# Altium schematic sheet SH08-PWR1.SchDoc
size A4
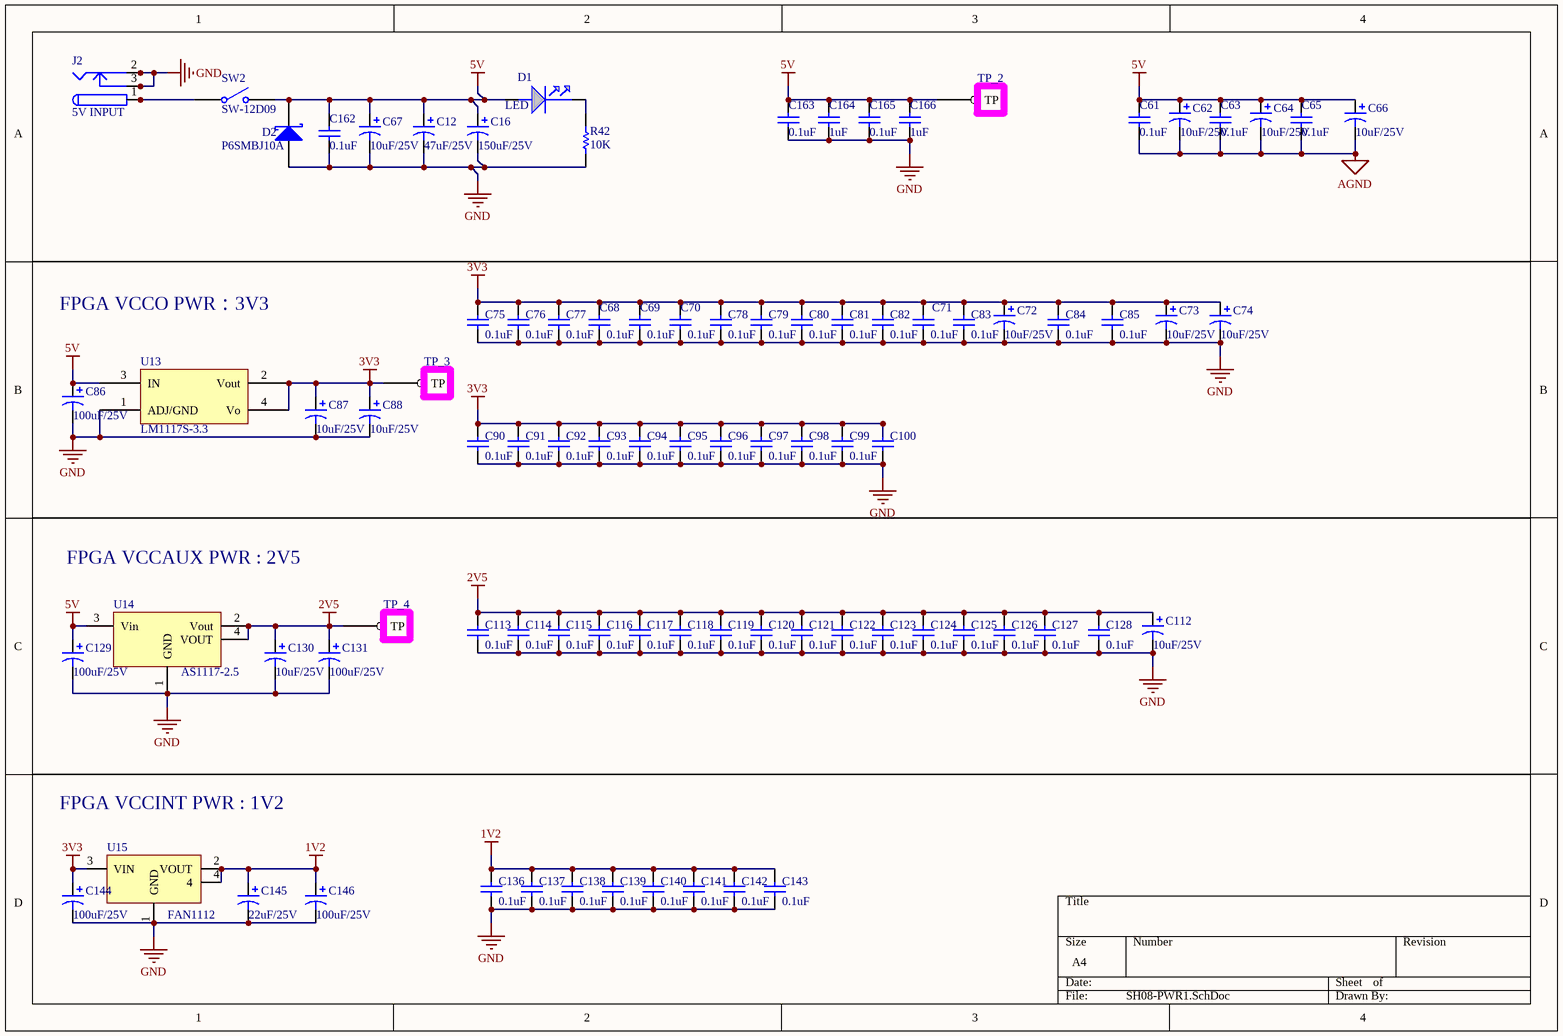
[diagram p0: SH08-PWR1.SchDoc]

## Parts
C12  value 47uF/25V  [1210[3528]]  (hidden comment: Cap Pol,47uF/25V,1210)
C16  value 150uF/25V  [7343]  (hidden comment: Cap Pol,150uF/25V,7343)
C61  value 0.1uF  [1608[0603]]  (hidden comment: Cap,0.1uF/0603)
C62  value 10uF/25V  [1206[3216]]  (hidden comment: Cap Pol,10uF/25V,1206)
C63  value 0.1uF  [1608[0603]]  (hidden comment: Cap,0.1uF/0603)
C64  value 10uF/25V  [1206[3216]]  (hidden comment: Cap Pol,10uF/25V,1206)
C65  value 0.1uF  [1608[0603]]  (hidden comment: Cap,0.1uF/0603)
C66  value 10uF/25V  [1206[3216]]  (hidden comment: Cap Pol,10uF/25V,1206)
C67  value 10uF/25V  [1206[3216]]  (hidden comment: Cap Pol,10uF/25V,1206)
C68  value 0.1uF  [1608[0603]]  (hidden comment: Cap,0.1uF/0603)
C69  value 0.1uF  [1608[0603]]  (hidden comment: Cap,0.1uF/0603)
C70  value 0.1uF  [1608[0603]]  (hidden comment: Cap,0.1uF/0603)
C71  value 0.1uF  [1608[0603]]  (hidden comment: Cap,0.1uF/0603)
C72  value 10uF/25V  [1206[3216]]  (hidden comment: Cap Pol,10uF/25V,1206)
C73  value 10uF/25V  [1206[3216]]  (hidden comment: Cap Pol,10uF/25V,1206)
C74  value 10uF/25V  [1206[3216]]  (hidden comment: Cap Pol,10uF/25V,1206)
C75  value 0.1uF  [1608[0603]]  (hidden comment: Cap,0.1uF/0603)
C76  value 0.1uF  [1608[0603]]  (hidden comment: Cap,0.1uF/0603)
C77  value 0.1uF  [1608[0603]]  (hidden comment: Cap,0.1uF/0603)
C78  value 0.1uF  [1608[0603]]  (hidden comment: Cap,0.1uF/0603)
C79  value 0.1uF  [1608[0603]]  (hidden comment: Cap,0.1uF/0603)
C80  value 0.1uF  [1608[0603]]  (hidden comment: Cap,0.1uF/0603)
C81  value 0.1uF  [1608[0603]]  (hidden comment: Cap,0.1uF/0603)
C82  value 0.1uF  [1608[0603]]  (hidden comment: Cap,0.1uF/0603)
C83  value 0.1uF  [1608[0603]]  (hidden comment: Cap,0.1uF/0603)
C84  value 0.1uF  [1608[0603]]  (hidden comment: Cap,0.1uF/0603)
C85  value 0.1uF  [1608[0603]]  (hidden comment: Cap,0.1uF/0603)
C86  value 100uF/25V  [1210[3528]]  (hidden comment: Cap Pol,100uF/25V,1210)
C87  value 10uF/25V  [1206[3216]]  (hidden comment: Cap Pol,10uF/25V,1206)
C88  value 10uF/25V  [1206[3216]]  (hidden comment: Cap Pol,10uF/25V,1206)
C90  value 0.1uF  [1608[0603]]  (hidden comment: Cap,0.1uF/0603)
C91  value 0.1uF  [1608[0603]]  (hidden comment: Cap,0.1uF/0603)
C92  value 0.1uF  [1608[0603]]  (hidden comment: Cap,0.1uF/0603)
C93  value 0.1uF  [1608[0603]]  (hidden comment: Cap,0.1uF/0603)
C94  value 0.1uF  [1608[0603]]  (hidden comment: Cap,0.1uF/0603)
C95  value 0.1uF  [1608[0603]]  (hidden comment: Cap,0.1uF/0603)
C96  value 0.1uF  [1608[0603]]  (hidden comment: Cap,0.1uF/0603)
C97  value 0.1uF  [1608[0603]]  (hidden comment: Cap,0.1uF/0603)
C98  value 0.1uF  [1608[0603]]  (hidden comment: Cap,0.1uF/0603)
C99  value 0.1uF  [1608[0603]]  (hidden comment: Cap,0.1uF/0603)
C100  Cap,0.1uF/0603  [1608[0603]]  (value not drawn)
C112  value 10uF/25V  [1206[3216]]  (hidden comment: Cap Pol,10uF/25V,1206)
C113  value 0.1uF  [1608[0603]]  (hidden comment: Cap,0.1uF/0603)
C114  value 0.1uF  [1608[0603]]  (hidden comment: Cap,0.1uF/0603)
C115  value 0.1uF  [1608[0603]]  (hidden comment: Cap,0.1uF/0603)
C116  value 0.1uF  [1608[0603]]  (hidden comment: Cap,0.1uF/0603)
C117  value 0.1uF  [1608[0603]]  (hidden comment: Cap,0.1uF/0603)
C118  value 0.1uF  [1608[0603]]  (hidden comment: Cap,0.1uF/0603)
C119  value 0.1uF  [1608[0603]]  (hidden comment: Cap,0.1uF/0603)
C120  value 0.1uF  [1608[0603]]  (hidden comment: Cap,0.1uF/0603)
C121  value 0.1uF  [1608[0603]]  (hidden comment: Cap,0.1uF/0603)
C122  value 0.1uF  [1608[0603]]  (hidden comment: Cap,0.1uF/0603)
C123  value 0.1uF  [1608[0603]]  (hidden comment: Cap,0.1uF/0603)
C124  value 0.1uF  [1608[0603]]  (hidden comment: Cap,0.1uF/0603)
C125  value 0.1uF  [1608[0603]]  (hidden comment: Cap,0.1uF/0603)
C126  value 0.1uF  [1608[0603]]  (hidden comment: Cap,0.1uF/0603)
C127  value 0.1uF  [1608[0603]]  (hidden comment: Cap,0.1uF/0603)
C128  value 0.1uF  [1608[0603]]  (hidden comment: Cap,0.1uF/0603)
C129  value 100uF/25V  [1210[3528]]  (hidden comment: Cap Pol,100uF/25V,1210)
C130  value 10uF/25V  [1206[3216]]  (hidden comment: Cap Pol,10uF/25V,1206)
C131  value 100uF/25V  [1210[3528]]  (hidden comment: Cap Pol,100uF/25V,1210)
C136  value 0.1uF  [1608[0603]]  (hidden comment: Cap,0.1uF/0603)
C137  value 0.1uF  [1608[0603]]  (hidden comment: Cap,0.1uF/0603)
C138  value 0.1uF  [1608[0603]]  (hidden comment: Cap,0.1uF/0603)
C139  value 0.1uF  [1608[0603]]  (hidden comment: Cap,0.1uF/0603)
C140  value 0.1uF  [1608[0603]]  (hidden comment: Cap,0.1uF/0603)
C141  value 0.1uF  [1608[0603]]  (hidden comment: Cap,0.1uF/0603)
C142  value 0.1uF  [1608[0603]]  (hidden comment: Cap,0.1uF/0603)
C143  value 0.1uF  [1608[0603]]  (hidden comment: Cap,0.1uF/0603)
C144  value 100uF/25V  [1210[3528]]  (hidden comment: Cap Pol,100uF/25V,1210)
C145  value 22uF/25V  [1210[3528]]  (hidden comment: Cap Pol,22uF/25V,1210)
C146  value 100uF/25V  [1210[3528]]  (hidden comment: Cap Pol,100uF/25V,1210)
C162  value 0.1uF  [1608[0603]]  (hidden comment: Cap,0.1uF/0603)
C163  value 0.1uF  [1608[0603]]  (hidden comment: Cap,0.1uF/0603)
C164  value 1uF  [2012[0805]]  (hidden comment: Cap,1uF/0805)
C165  value 0.1uF  [1608[0603]]  (hidden comment: Cap,0.1uF/0603)
C166  value 1uF  [2012[0805]]  (hidden comment: Cap,1uF/0805)
D1  LED  [2012[0805] - LED]
D2  P6SMBJ10A  [SMBJ10A_DIOM4336X24N]
J2  5V INPUT  [IF_KLD-0202]
R42  value 10K  [1608[0603]]  (hidden comment: Res,10K/0603)
SW2  SW-12D09  [SW_SD12D09]
TP_2  5V  [MYTP]  (value not drawn)
TP_3  3V3  [MYTP]  (value not drawn)
TP_4  2V5  [MYTP]  (value not drawn)
U13  LM1117S-3.3  [TO-263-3SMD]
U14  AS1117-2.5  [SOT223P700X180-4N]
U15  FAN1112  [SOT-223(FAN1112)]

## Nets
1V2: C136.2 C137.2 C138.2 C139.2 C140.2 C141.2 C142.2 C143.2 C145.1 C146.1 U15.2(VOUT) U15.4
2V5: C112.1 C113.2 C114.2 C115.2 C116.2 C117.2 C118.2 C119.2 C120.2 C121.2 C122.2 C123.2 C124.2 C125.2 C126.2 C127.2 C128.2 C130.1 C131.1 TP_4.1(TP) U14.2(Vout) U14.4(VOUT)
3V3: C68.2 C69.2 C70.2 C71.2 C72.1 C73.1 C74.1 C75.2 C76.2 C77.2 C78.2 C79.2 C80.2 C81.2 C82.2 C83.2 C84.2 C85.2 C87.1 C88.1 C90.2 C91.2 C92.2 C93.2 C94.2 C95.2 C96.2 C97.2 C98.2 C99.2 C100.2 C144.1 TP_3.1(TP) U13.2(Vout) U13.4(Vo) U15.3(VIN)
5V: C12.1 C16.1 C61.1 C62.1 C63.1 C64.1 C65.1 C66.1 C67.1 C86.1 C129.1 C162.1 C163.1 C164.1 C165.1 C166.1 D1.1 D2.2(K) SW2.2(NO) TP_2.1(TP) U13.3(IN) U14.3(Vin)
AGND: C61.2 C62.2 C63.2 C64.2 C65.2 C66.2
GND: C12.2 C16.2 C67.2 C68.1 C69.1 C70.1 C71.1 C72.2 C73.2 C74.2 C75.1 C76.1 C77.1 C78.1 C79.1 C80.1 C81.1 C82.1 C83.1 C84.1 C85.1 C86.2 C87.2 C88.2 C90.1 C91.1 C92.1 C93.1 C94.1 C95.1 C96.1 C97.1 C98.1 C99.1 C100.1 C112.2 C113.1 C114.1 C115.1 C116.1 C117.1 C118.1 C119.1 C120.1 C121.1 C122.1 C123.1 C124.1 C125.1 C126.1 C127.1 C128.1 C129.2 C130.2 C131.2 C136.1 C137.1 C138.1 C139.1 C140.1 C141.1 C142.1 C143.1 C144.2 C145.2 C146.2 C162.2 C163.2 C164.2 C165.2 C166.2 D2.1(A) J2.2 J2.2A J2.2B J2.3 J2.3A J2.3B R42.1 U13.1(ADJ/GND) U14.1(GND) U15.1(GND)
NetD1_2: D1.2 R42.2
NetJ2_1: J2.1 J2.1A J2.1B SW2.1(COMMON)

## Notes on the sheet
- FPGA VCCO PWR：3V3
- FPGA VCCAUX PWR : 2V5
- FPGA VCCINT PWR : 1V2

## Library data of the parts
C12 C16 C62 C64 C66 C67 C72-C74 C86-C88 C112 C129-C131 C144-C146 = Cap Pol1: Polarized Capacitor (Radial); Published: 8-Jun-2000; LatestRevisionDate: 17-Jul-2002; LatestRevisionNote: Re-released for DXP Platform.; PackageReference: RB7.6-15; Publisher: Altium Limited
C61 C63 C65 C68-C71 C75-C85 C90-C100 C113-C128 C136-C143 C162-C166 = Cap: Capacitor; Published: 8-Jun-2000; LatestRevisionDate: 17-Jul-2002; LatestRevisionNote: Re-released for DXP Platform.; PackageReference: RAD-0.3; Publisher: Altium Limited
D1 = LED: Text Field1: 40; Text Field2: 20
D2 = Diode 11DQ03: Schottky Rectifier; Published: 8-Jun-2000; LatestRevisionDate: 17-Jul-2002; LatestRevisionNote: Re-released for DXP Platform.; DatasheetDocument: Dec-1997; PackageReference: DO-204AL; Publisher: Altium Limited; Code_JEDEC: DO-204-AL; ComponentLink1Description: Manufacturer Link; ComponentLink1URL: http://www.irf.com/; ComponentLink2Description: Datasheet; ComponentLink2URL: http://www.irf.com/product-info/datasheets/data/11dq03.pdf
J2 = PWR2.5: Low Voltage Power Supply Connector; Published: 17-Dec-2003; DatasheetDocument: 09-May-2002; Publisher: Altium Limited; ComponentLink1Description: Manufacturer Link; ComponentLink1URL: http://domino.kycon.com/internet/Products.html
R42 = Res1: Resistor; Published: 8-Jun-2000; LatestRevisionDate: 17-Jul-2002; LatestRevisionNote: Re-released for DXP Platform.; PackageReference: AXIAL-0.3; Publisher: Altium Limited
SW2 = SW-SPST: Single-Pole, Single-Throw Switch; Published: 24-Mar-1999; LatestRevisionDate: 17-Jul-2002; LatestRevisionNote: Re-released for DXP Platform.; PackageReference: SPST-2; Publisher: Altium Limited
TP_2-TP_4 = TEST POINT_0: Right: 10; Bottom: 20
U13 = PWR_LM1117S-3.3
U14 = VOLTREG